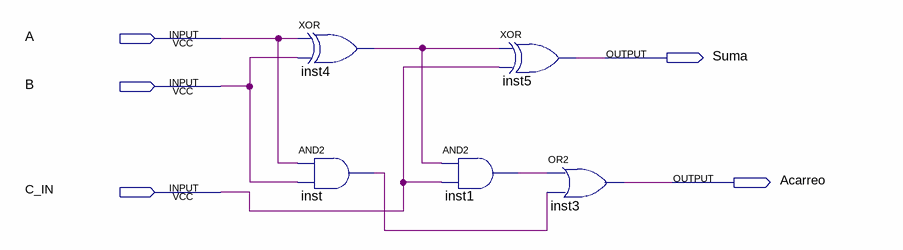
[diagram p0: schematic sheet]
// Quartus schematic sumador1bit.bdf as structural Verilog: 5 symbols, 5 pins
module sumador1bit (
  input  A,
  input  B,
  input  C_IN,
  output Suma,
  output Acarreo
);

  wire inst1_out, inst4_out, inst_out;

  xor inst4 (inst4_out, A, B);
  and inst (inst_out, A, B);
  and inst1 (inst1_out, inst4_out, C_IN);
  xor inst5 (Suma, inst4_out, C_IN);
  or inst3 (Acarreo, inst1_out, inst_out);
endmodule
